# Altium schematic sheet CarCharger.SchDoc: Test
size A4; DrawnBy: Łukasz Przeniosło; Organization: PRZENIOSLO; Address1: Electronics; Address2: &; Address3: Software; DocumentNumber: 1; Revision: 1.0; SheetNumber: 1; SheetTotal: 1
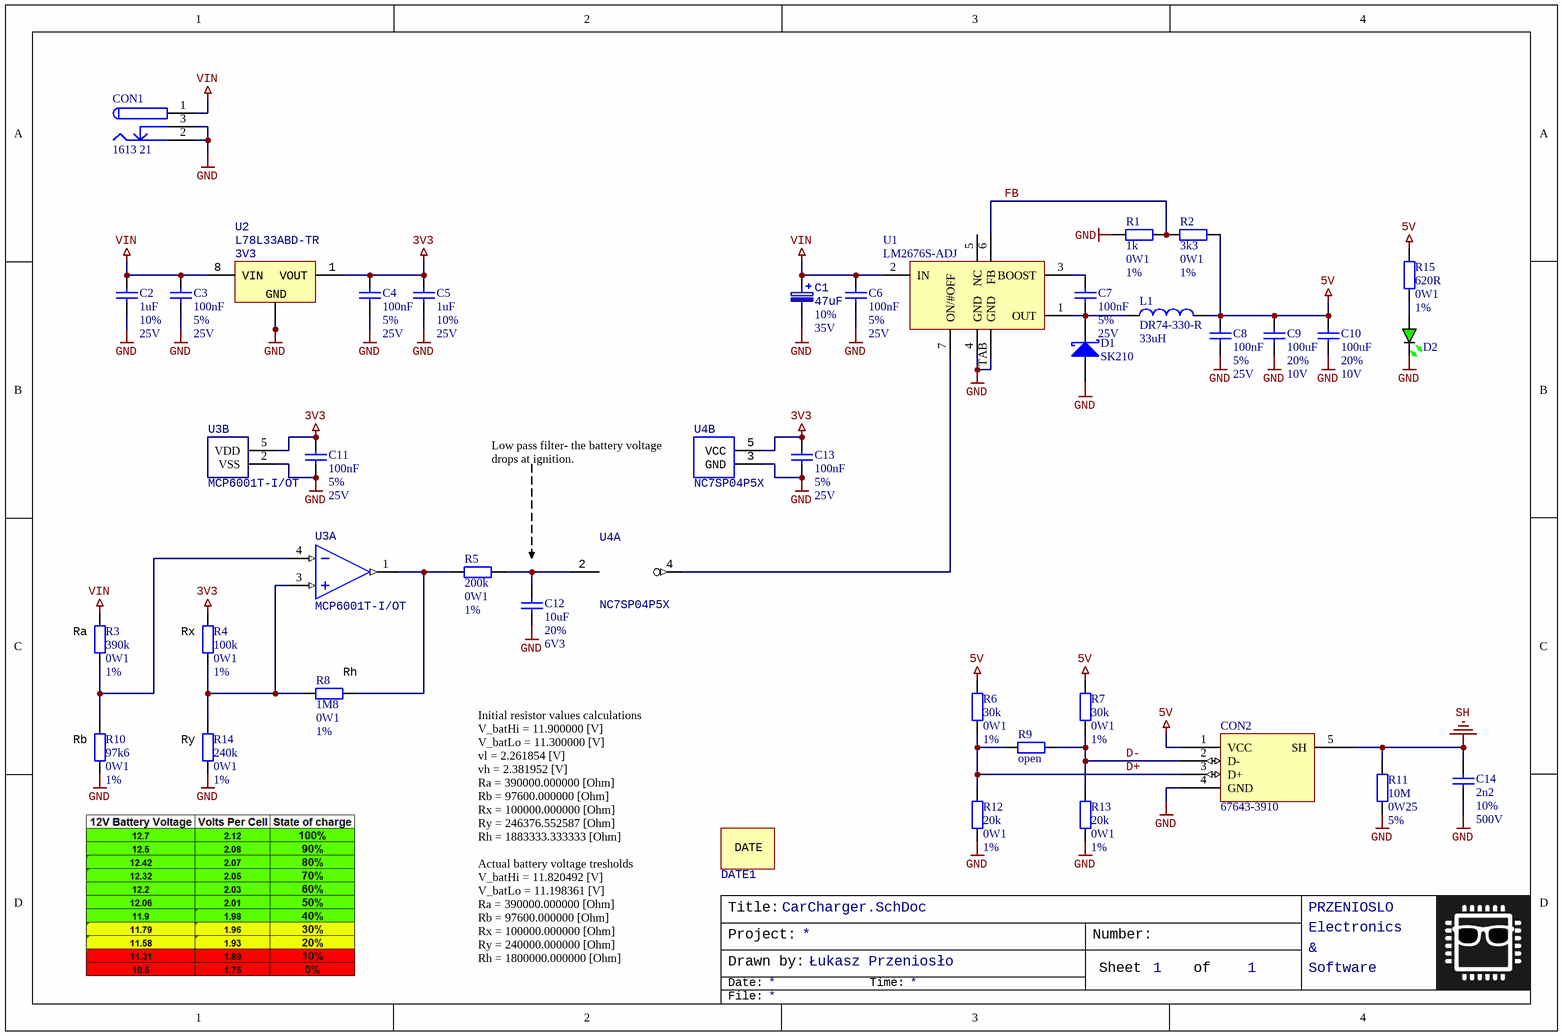
[diagram p0: CarCharger.SchDoc]

## Parts
C1  47uF  Tolerance: 10%  Voltage: 35V  [SMDD]
C2  1uF  Tolerance: 10%  Voltage: 25V  [CAPC1608N]
C3  100nF  Tolerance: 5%  Voltage: 25V  [CAPC1608N]
C4  100nF  Tolerance: 5%  Voltage: 25V  [CAPC1608N]
C5  1uF  Tolerance: 10%  Voltage: 25V  [CAPC1608N]
C6  100nF  Tolerance: 5%  Voltage: 25V  [CAPC1608N]
C7  100nF  Tolerance: 5%  Voltage: 25V  [CAPC1608N]
C8  100nF  Tolerance: 5%  Voltage: 25V  [CAPC1608N]
C9  100uF  Tolerance: 20%  Voltage: 10V  [CAPC3225N]
C10  100uF  Tolerance: 20%  Voltage: 10V  [CAPC3225N]
C11  100nF  Tolerance: 5%  Voltage: 25V  [CAPC1608N]
C12  10uF  Tolerance: 20%  Voltage: 6V3  [CAPC1608N]
C13  100nF  Tolerance: 5%  Voltage: 25V  [CAPC1608N]
C14  2n2  Tolerance: 10%  Voltage: 500V  [CAPC3216N]
CON1  1613 21  [JACK-2.5]
CON2  67643-3910  [USB-A-socket]
D1  SK210  [SMB]
D2  Led Green  [CD2012-0805-GRN]  (value not drawn)
DATE1  DATE  [DATE]  (value not drawn)
L1  DR74-330-R  value 33uH  [DR74 Series]
R1  1k  Power: 0W1  Tolerance: 1%  [RESC1608N]
R2  3k3  Power: 0W1  Tolerance: 1%  [RESC1608N]
R3  390k  Power: 0W1  Tolerance: 1%  [RESC1608N]
R4  100k  Power: 0W1  Tolerance: 1%  [RESC1608N]
R5  200k  Power: 0W1  Tolerance: 1%  [RESC1608N]
R6  30k  Power: 0W1  Tolerance: 1%  [RESC1608N]
R7  30k  Power: 0W1  Tolerance: 1%  [RESC1608N]
R8  1M8  Power: 0W1  Tolerance: 1%  [RESC1608N]
R9  open  [RESC1608N]
R10  97k6  Power: 0W1  Tolerance: 1%  [RESC1608N]
R11  10M  Power: 0W25  Tolerance: 5%  [RESC3216N]
R12  20k  Power: 0W1  Tolerance: 1%  [RESC1608N]
R13  20k  Power: 0W1  Tolerance: 1%  [RESC1608N]
R14  240k  Power: 0W1  Tolerance: 1%  [RESC1608N]
R15  620R  Power: 0W1  Tolerance: 1%  [RESC1608N]
U1  LM2676S-ADJ  [TO-263-7]
U2  L78L33ABD-TR  VOUT: 3V3  [SO-8_L]
U3  MCP6001T-I/OT  [SOT23-5_N]  (parts A,B of 2)
U4  NC7SP04P5X  [sc70]  (parts A,B of 2)

## Nets
3V3: C4.2 C5.2 C11.2 C13.2 R4.2 U2.1(VOUT) U3.5(VDD) U4.5(VCC)
5V: C8.2 C9.1 C10.1 CON2.1(VCC) L1.2 R2.2 R6.2 R7.2 R15.2
GND: C1.2 C2.1 C3.1 C4.1 C5.1 C6.1 C8.1 C9.2 C10.2 C11.1 C12.1 C13.1 C14.1 CON1.2 CON1.3 CON2.4(GND) D1.1(A) D2.2(K) R1.1 R10.1 R11.1 R12.1 R13.1 R14.1 U1.4(GND) U1.TAB(GND) U2.2(GND) U2.3(GND) U2.6(GND) U2.7(GND) U3.2(VSS) U4.3(GND)
SH: C14.2 CON2.5(SH) R11.2
VIN: C1.1 C2.2 C3.2 C6.2 CON1.1 R3.2 U1.2(IN) U2.8(VIN)
D+: CON2.3(D+) R6.1 R9.1 R12.2
D-: CON2.2(D-) R7.1 R9.2 R13.2
FB: R1.2 R2.1 U1.6(FB)
NetC7_1: C7.1 D1.2(K) L1.1 U1.1(OUT)
NetC7_2: C7.2 U1.3(BOOST)
NetC12_2: C12.2 R5.2 U4.2(A)
NetD2_1: D2.1(A) R15.1
NetR3_1: R3.1 R10.2 U3.4(-IN)
NetR4_1: R4.1 R8.1 R14.2 U3.3(+IN)
NetR5_1: R5.1 R8.2 U3.1(OUT)
NetU1_7: U1.7(ON/#OFF) U4.4(Y)

Not connected (* = marked no-connect by the designer): U1 5(NC); U4 1(NC)

## Notes on the sheet
- Low pass filter- the battery voltage drops at ignition.
- (near R3) Ra
- (near R4) Rx
- (near R8) Rh
- (near R10) Rb
- (near R14) Ry
- Initial resistor values calculations
  V_batHi = 11.900000 [V]
  V_batLo = 11.300000 [V]
  vl = 2.261854 [V]
  vh = 2.381952 [V]
  Ra = 390000.000000 [Ohm]
  Rb = 97600.000000 [Ohm]
  Rx = 100000.000000 [Ohm]
  Ry = 246376.552587 [Ohm]
  Rh = 1883333.333333 [Ohm]
  Actual battery voltage tresholds
  V_batHi = 11.820492 [V]
  V_batLo = 11.198361 [V]
  Ra = 390000.000000 [Ohm]
  Rb = 97600.000000 [Ohm]
  Rx = 100000.000000 [Ohm]
  Ry = 240000.000000 [Ohm]
  Rh = 1800000.000000 [Ohm]
- Title:
- Date:
- Drawn by:
- Project:
- Time:
- Number:
- Sheet
- of
- File:

## Library data of the parts
C1 = cap_electro: manid: T491X476K035AT; Value: 47uF
C2-C14 = Capacitor
  C2 C5: Value: 1uF
  C3 C4 C6-C8 C11 C13: Value: 100nF
  C9 C10: Value: 100uF
  C12: Value: 10uF
  C14: Value: 2n2
CON1 = JACK-2.5: Low Voltage Power Supply Connector; manid: 1613 21
CON2 = USB-A-Sock: manid: 67643-3910
D1 = MBRS340T3: Schottky Barrier Rectifier,  40V, 3A; PackageReference: SMC; Distributor: *; Distributor Order Code: *; Manufacturer Part No.: *; tme.pl: MBRS340T3
D2 = Led Green: Typical GRN LED; Current: 10mA; manid: LTST-C170GKT
L1 = DR74-330-R: elfa.se: 58-101-14; Published: 8-Jun-2000; PackageDocument: Sep-1998; Publisher: Altium Limited; ComponentLink1Description: Manufacturer Link; ComponentLink2Description: Datasheet; Distributor: tme.pl
R1-R8 R10-R15 = Resistor
  R1: Value: 1k
  R2: Value: 3k3
  R3: Value: 390k
  R4: Value: 100k
  R5: Value: 200k
  R6 R7: Value: 30k
  R8: Value: 1M8
  R10: Value: 97k6
  R11: Value: 10M
  R12 R13: Value: 20k
  R14: Value: 240k
  R15: Value: 620R
R9 = Resistor: Tolerance: 5%; Power: 0W; Value: open
U1 = LM2676S-ADJ: SIMPLE SWITCHER High Efficiency 3A Step-Down Voltage Regulator; elfa.se: 73-068-81; ComponentLink1Description: Manufacturer Link; ComponentLink1URL: http://www.national.com/; ComponentLink2Description: Datasheet; ComponentLink2URL: http://www.national.com/ds.cgi/LM/LM2676.pdf; Distributor: tme.pl; farnell: 1469211; manid: LM2676S-ADJ
U2 = L78LXXAXD: Positive voltage regulators; manid: L78L33ABD-TR
U3 = MCP6001: 1 MHz, Low-Power Op Amp; manid: MCP6001T-I/OT
U4 = NC7SP04: tiny logic inverter; manid: NC7SP04P5X